# Altium schematic sheet Output_Distribution.SchDoc (part 1 of 3)
size 431 x 279 mm; Organization: ORGANIZATION; Address1: ADDRESS 1; Address2: ADDRESS 2; Address3: ADDRESS 3; Address4: ADDRESS 4; Revision: -; SheetNumber: 6; SheetTotal: 6; ENG_APP_DATE: --/--/--; DSN_APP_DATE: --/--/--; CHK_APP_DATE: --/--/--
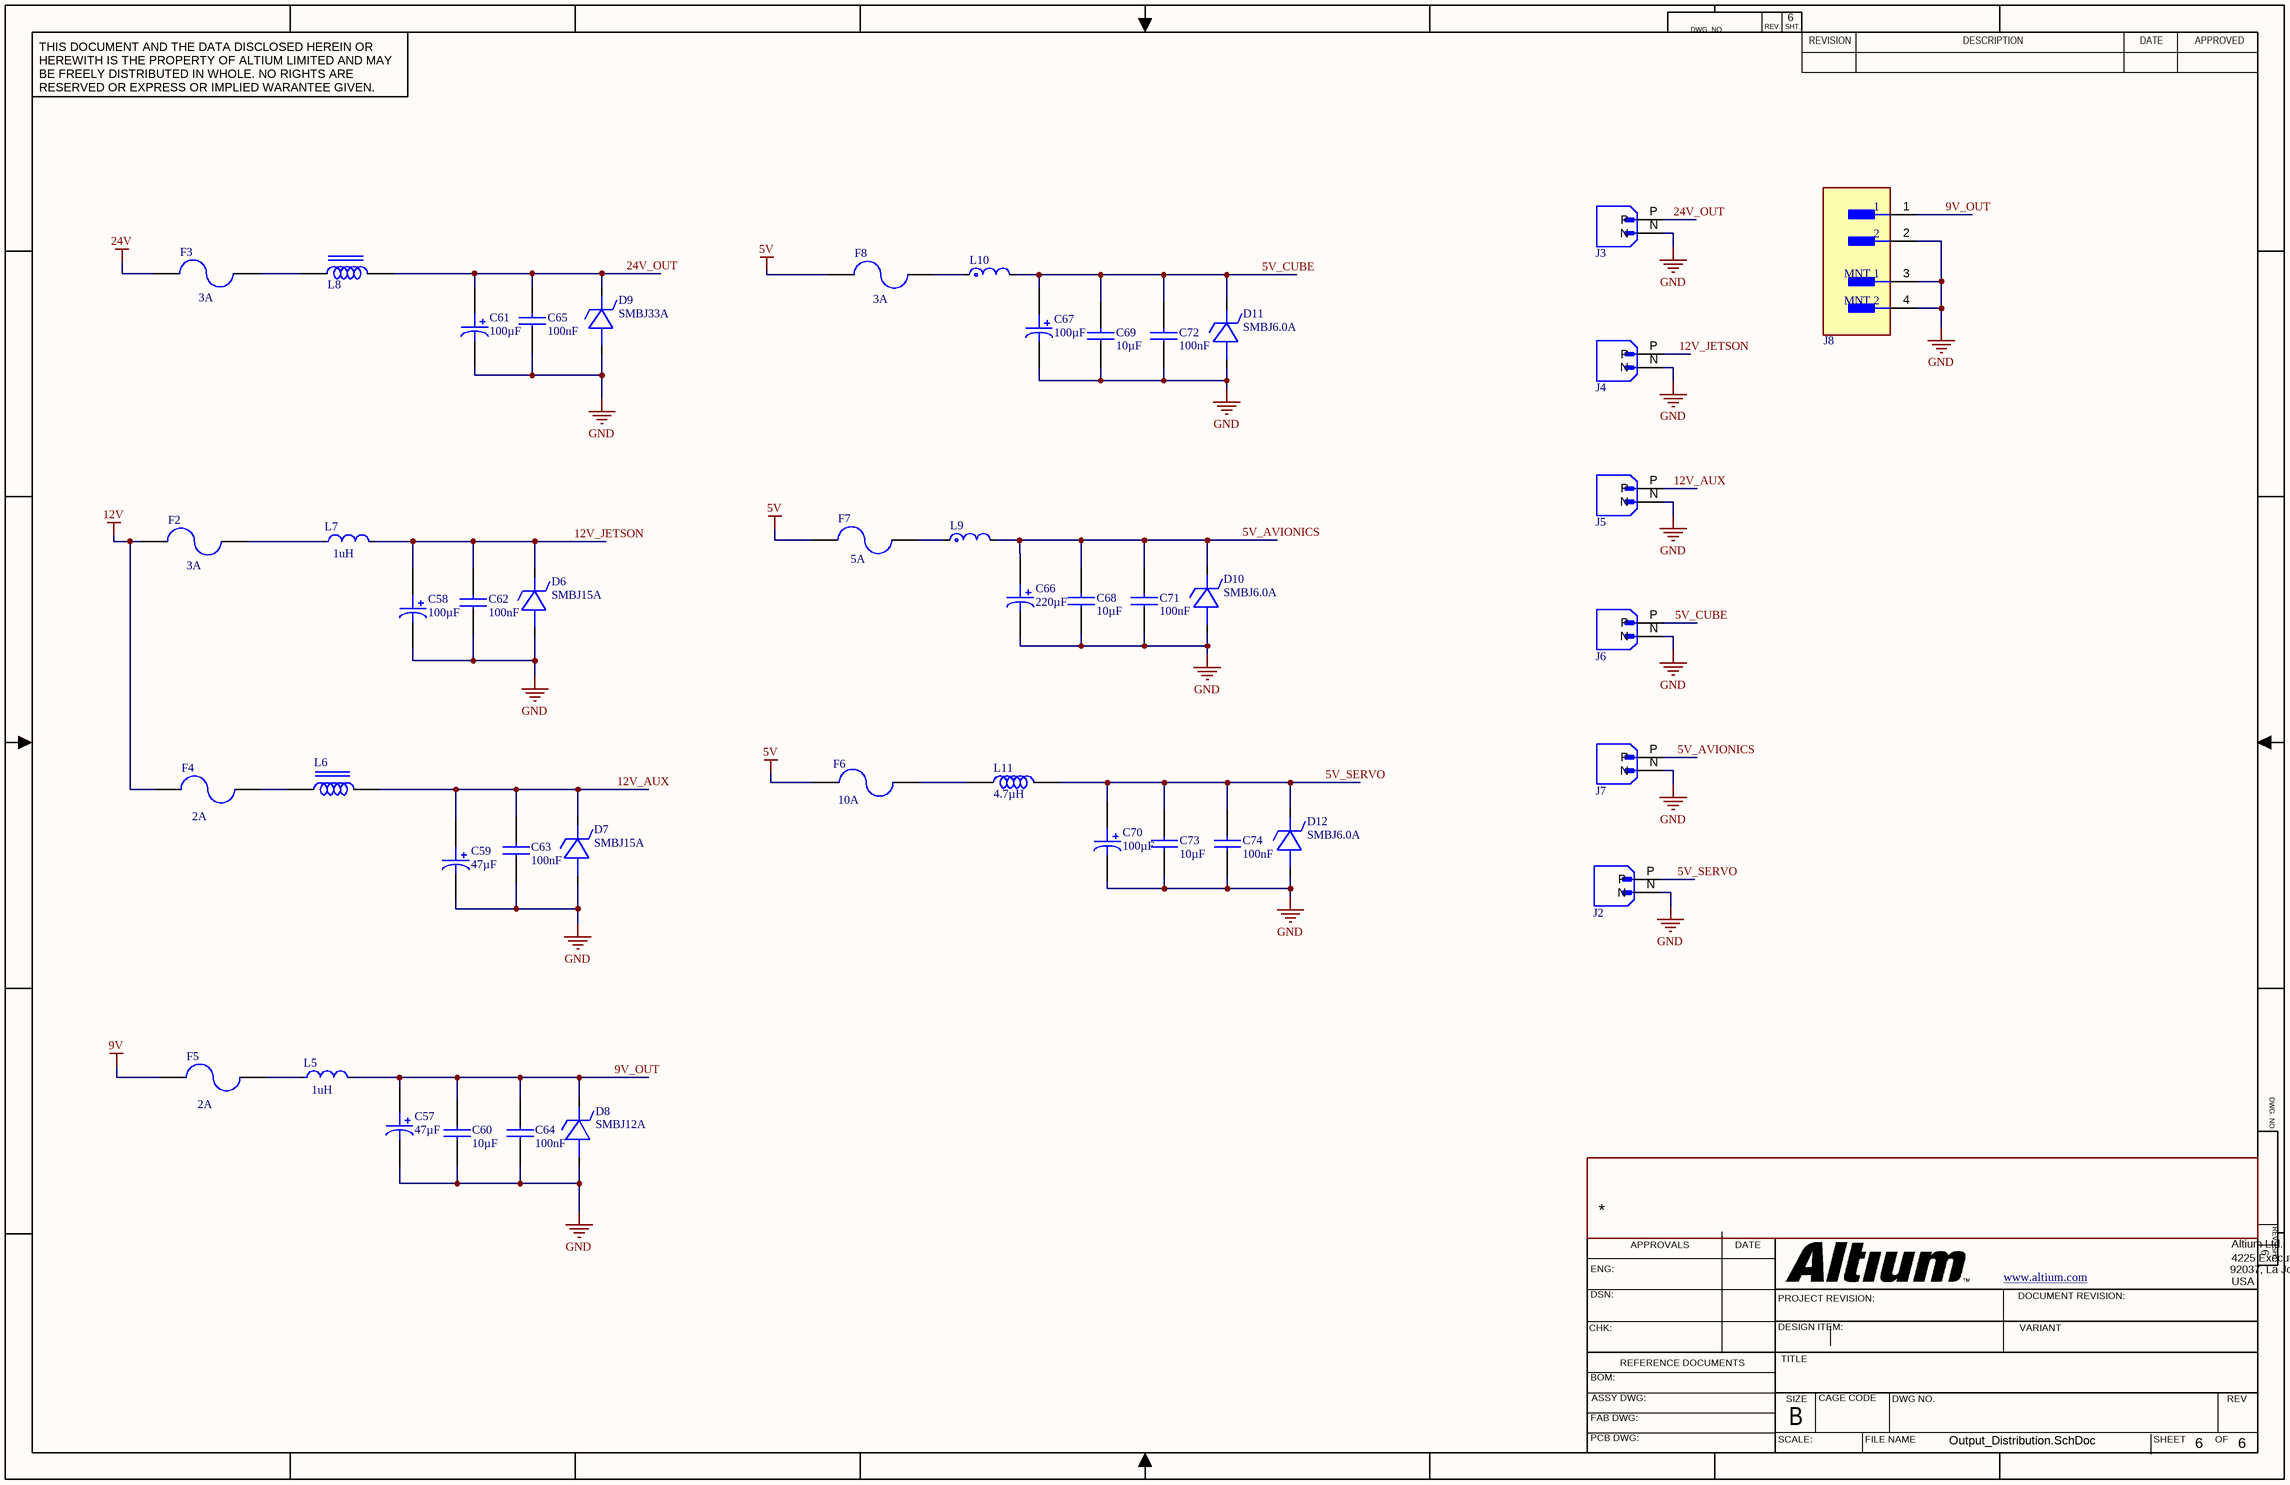
[diagram p0: Output_Distribution.SchDoc]

## Parts
C57  value 47µF  [CAP ALUM SMD]  (hidden comment: EEH-ZA1H470P)
C58  value 100µF  [CAP ALUM SMD]  (hidden comment: EEH-ZA1V101P)
C59  value 47µF  [CAP ALUM SMD]  (hidden comment: EEH-ZA1H470P)
C60  value 10µF  [CAP_1210_S]  (hidden comment: CL32A106KBJNNNE)
C61  value 100µF  [CAP ALUM SMD]  (hidden comment: EEH-ZA1V101P)
C62  value 100nF  [CAP_0603]  (hidden comment: CGA3E2X7R1H104K080AA)
C63  value 100nF  [CAP_0603]  (hidden comment: CGA3E2X7R1H104K080AA)
C64  value 100nF  [CAP_0603]  (hidden comment: CGA3E2X7R1H104K080AA)
C65  value 100nF  [CAP_0603]  (hidden comment: CGA3E2X7R1H104K080AA)
C66  value 220µF  [CAP ALUM SMD]  (hidden comment: EEHZA1A221P)
C67  value 100µF  [CAP ALUM SMD]  (hidden comment: EEH-ZA1V101P)
C68  value 10µF  [CAP_1210_S]  (hidden comment: CL32A106KBJNNNE)
C69  value 10µF  [CAP_1210_S]  (hidden comment: CL32A106KBJNNNE)
C70  value 100µF  [CAP ALUM SMD]  (hidden comment: EEH-ZA1V101P)
C71  value 100nF  [CAP_0603]  (hidden comment: CGA3E2X7R1H104K080AA)
C72  value 100nF  [CAP_0603]  (hidden comment: CGA3E2X7R1H104K080AA)
C73  value 10µF  [CAP_1210_S]  (hidden comment: CL32A106KBJNNNE)
C74  value 100nF  [CAP_0603]  (hidden comment: CGA3E2X7R1H104K080AA)
D6  SMBJ15A  [SMB (DO-214AA)]
D7  SMBJ15A  [SMB (DO-214AA)]
D8  SMBJ12A  [SMB (DO-214AA)]
D9  SMBJ33A  [SMB (DO-214AA)]
D10  SMBJ6.0A  [SMB (DO-214AA)]
D11  SMBJ6.0A  [SMB (DO-214AA)]
D12  SMBJ6.0A  [SMB (DO-214AA)]
F2  Current Rating: 3A  [FUSE_2410]  (hidden comment: Littelfuse 0452003.MRL)
F3  Current Rating: 3A  [FUSE_2410]  (hidden comment: Littelfuse 0452003.MRL)
F4  Fuse Current: 2A  [FUSE_2410]  (hidden comment: Littelfuse 0452002.MRL)
F5  Fuse Current: 2A  [FUSE_2410]  (hidden comment: Littelfuse 0452002.MRL)
F6  Current Rating: 10A  [FUSE_2410]  (hidden comment: Littelfuse 0452010.MRL)
F7  Fuse Current: 5A  [FUSE_2410]  (hidden comment: Littelfuse 0452005.MRL)
F8  Current Rating: 3A  [FUSE_2410]  (hidden comment: Littelfuse 0452003.MRL)
J2  XT30PW-M  [XT30PW-M]  (value not drawn)
J3  XT30PW-M  [XT30PW-M]  (value not drawn)
J4  XT30PW-M  [XT30PW-M]  (value not drawn)
J5  XT30PW-M  [XT30PW-M]  (value not drawn)
J6  XT30PW-M  [XT30PW-M]  (value not drawn)
J7  XT30PW-M  [XT30PW-M]  (value not drawn)
J8  SM02B-GHS-TB  [SM02B-GHS-TB]  (value not drawn)
L5  value 1uH  [FP-XAL4020-102MEC-MFG]  (hidden comment: XAL4020-102MEC)
L6  BLM31PG601SN1L  [CAP_1206]  (value not drawn)
L7  value 1uH  [FP-XAL4020-102MEC-MFG]  (hidden comment: XAL4020-102MEC)
L8  BLM31SN500SH1L  [CAP_1206]  (value not drawn)
L9  XAL5030-222MEC  [FP-XAL5030-222MEC-MFG]  (value not drawn)
L10  XAL5030-222MEC  [FP-XAL5030-222MEC-MFG]  (value not drawn)
L11  value 4.7µH  [XAL6060]  (hidden comment: XAL6060-472MEB)

## Nets
5V: F6.1 F7.1 F8.1
9V: F5.1
12V: F2.1 F4.1
24V: F3.1
GND: C57.2(A) C58.2(A) C59.2(A) C60.1 C61.2(A) C62.1 C63.1 C64.1 C65.1 C66.2(A) C67.2(A) C68.1 C69.1 C70.2(A) C71.1 C72.1 C73.1 C74.1 D6.2 D7.2 D8.2 D9.2 D10.2 D11.2 D12.2 J2.N J3.N J4.N J5.N J6.N J7.N J8.2 J8.3(MNT_1) J8.4(MNT_2)
5V_AVIONICS: C66.1(C) C68.2 C71.2 D10.1 J7.P L9.2
5V_CUBE: C67.1(C) C69.2 C72.2 D11.1 J6.P L10.2
5V_SERVO: C70.1(C) C73.2 C74.2 D12.1 J2.P L11.2
9V_OUT: C57.1(C) C60.2 C64.2 D8.1 J8.1 L5.2
12V_AUX: C59.1(C) C63.2 D7.1 J5.P L6.2
12V_JETSON: C58.1(C) C62.2 D6.1 J4.P L7.2
24V_OUT: C61.1(C) C65.2 D9.1 J3.P L8.2
NetF2_2: F2.2 L7.1
NetF3_2: F3.2 L8.1
NetF4_2: F4.2 L6.1
NetF5_2: F5.2 L5.1
NetF6_2: F6.2 L11.1
NetF7_2: F7.2 L9.1
NetF8_2: F8.2 L10.1

## Notes on the sheet
- DWG. NO.
- REV.
- SHT.
- THIS DOCUMENT AND THE DATA DISCLOSED HEREIN OR HEREWITH IS THE PROPERTY OF ALTIUM LIMITED AND MAY BE FREELY DISTRIBUTED IN WHOLE. NO RIGHTS ARE RESERVED OR EXPRESS OR IMPLIED WARANTEE GIVEN.
- REVISION
- DESCRIPTION
- DATE
- APPROVED
- ENG:
- DSN:
- APPROVALS
- PROJECT REVISION:
- www.altium.com <http://www.altium.com>
- DOCUMENT REVISION:
- 92037, La Jolla
- USA
- Altium Ltd.
- 4225 Executive Square
- CHK:
- REFERENCE DOCUMENTS
- DESIGN ITEM:
- TITLE
- VARIANT
- BOM:
- FAB DWG:
- PCB DWG:
- ASSY DWG:
- SCALE:
- SIZE
- B
- CAGE CODE
- FILE NAME
- DWG NO.
- SHEET
- OF
- REV